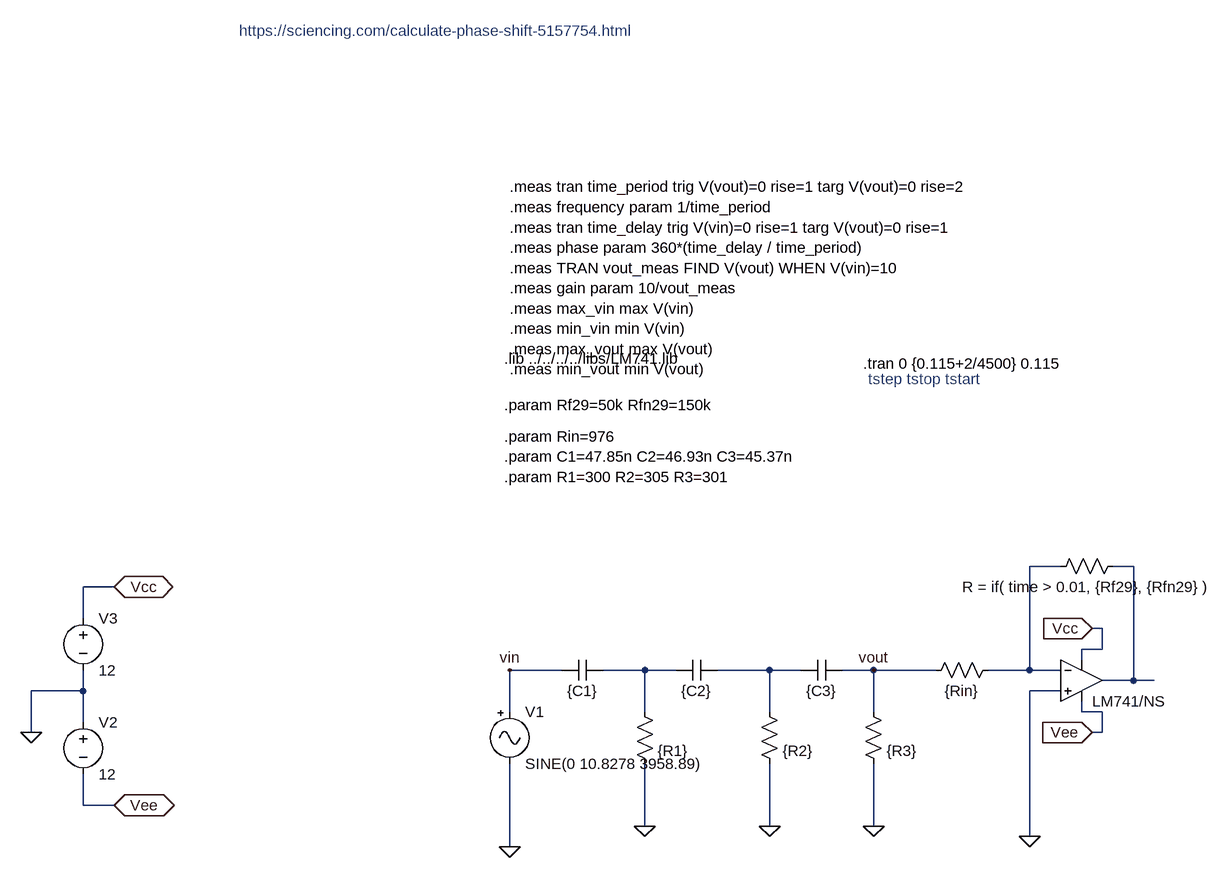
[diagram p0: schematic debugB_practical.asc]
debugB_practical.asc, the LTspice schematic file:
Version 4
SHEET 1 1348 1128
WIRE 752 -112 704 -112
WIRE 864 -112 832 -112
WIRE -704 -80 -752 -80
WIRE -752 -32 -752 -80
WIRE 816 -16 800 -16
WIRE 816 16 816 -16
WIRE 816 16 784 16
WIRE 784 32 784 16
WIRE -16 48 -96 48
WIRE 112 48 48 48
WIRE 160 48 112 48
WIRE 304 48 224 48
WIRE 352 48 304 48
WIRE 464 48 416 48
WIRE 560 48 464 48
WIRE 704 48 704 -112
WIRE 704 48 640 48
WIRE 752 48 704 48
WIRE 864 64 864 -112
WIRE 864 64 816 64
WIRE 896 64 864 64
WIRE -752 80 -752 48
WIRE -752 80 -832 80
WIRE 752 80 704 80
WIRE -96 112 -96 48
WIRE 112 112 112 48
WIRE 304 112 304 48
WIRE 464 112 464 48
WIRE 784 112 784 96
WIRE 816 112 784 112
WIRE -752 128 -752 80
WIRE -832 144 -832 80
WIRE 816 144 816 112
WIRE 816 144 800 144
WIRE -752 256 -752 208
WIRE -704 256 -752 256
WIRE 112 288 112 192
WIRE 304 288 304 192
WIRE 464 288 464 192
WIRE 704 304 704 80
WIRE -96 320 -96 192
FLAG 112 288 0
FLAG 304 288 0
FLAG 800 -16 Vcc
IOPIN 800 -16 In
FLAG 800 144 Vee
IOPIN 800 144 In
FLAG 704 304 0
FLAG 464 288 0
FLAG -832 144 0
FLAG -704 -80 Vcc
IOPIN -704 -80 BiDir
FLAG -704 256 Vee
IOPIN -704 256 BiDir
FLAG 464 48 vout
FLAG -96 48 vin
FLAG -96 320 0
SYMBOL opamp2 784 0 R0
WINDOW 0 16 32 Invisible 2
SYMATTR InstName U1
SYMATTR Value LM741/NS
SYMBOL res 848 -128 R90
WINDOW 0 0 56 Invisible 2
WINDOW 3 32 56 VTop 2
SYMATTR InstName R1
SYMATTR Value R = if( time > 0.01, {Rf29}, {Rfn29} )
SYMBOL res 656 32 R90
WINDOW 0 0 56 Invisible 2
WINDOW 3 32 56 VTop 2
SYMATTR InstName R2
SYMATTR Value {Rin}
SYMBOL cap 48 32 R90
WINDOW 0 0 32 Invisible 2
WINDOW 3 32 32 VTop 2
SYMATTR InstName C1
SYMATTR Value {C1}
SYMBOL cap 224 32 R90
WINDOW 0 0 32 Invisible 2
WINDOW 3 32 32 VTop 2
SYMATTR InstName C2
SYMATTR Value {C2}
SYMBOL cap 416 32 R90
WINDOW 0 0 32 Invisible 2
WINDOW 3 32 32 VTop 2
SYMATTR InstName C3
SYMATTR Value {C3}
SYMBOL res 96 96 R0
WINDOW 0 36 40 Invisible 2
SYMATTR InstName R3
SYMATTR Value {R1}
SYMBOL res 288 96 R0
WINDOW 0 36 40 Invisible 2
SYMATTR InstName R4
SYMATTR Value {R2}
SYMBOL res 448 96 R0
WINDOW 0 36 40 Invisible 2
SYMATTR InstName R5
SYMATTR Value {R3}
SYMBOL voltage -752 112 R0
SYMATTR InstName V2
SYMATTR Value 12
SYMBOL voltage -752 -48 R0
SYMATTR InstName V3
SYMATTR Value 12
SYMBOL Misc/signal -96 96 R0
SYMATTR InstName V1
SYMATTR Value SINE(0 10.8278 3958.89)
TEXT -104 -432 Left 2 !.lib ../../../../libs/LM741.lib
TEXT -104 -312 Left 2 !.param Rin=976\n.param C1=47.85n C2=46.93n C3=45.37n\n.param R1=300 R2=305 R3=301
TEXT 448 -424 Left 2 !.tran 0 {0.115+2/4500} 0.115
TEXT 456 -400 Left 2 ;tstep tstop tstart
TEXT -104 -360 Left 2 !.param Rf29=50k Rfn29=150k
TEXT -96 -696 Left 2 !.meas tran time_period trig V(vout)=0 rise=1 targ V(vout)=0 rise=2\n.meas frequency param 1/time_period\n.meas tran time_delay trig V(vin)=0 rise=1 targ V(vout)=0 rise=1\n.meas phase param 360*(time_delay / time_period)\n.meas TRAN vout_meas FIND V(vout) WHEN V(vin)=10\n.meas gain param 10/vout_meas\n.meas max_vin max V(vin)\n.meas min_vin min V(vin)\n.meas max_vout max V(vout)\n.meas min_vout min V(vout)
TEXT -512 -936 Left 2 ;https://sciencing.com/calculate-phase-shift-5157754.html

The netlist it stands for:
* debugB_practical.asc
XU1 0 N001 Vcc Vee N002 LM741/NS  ; pins In+ In- V+ V- OUT
R1 N002 N001 R = if( time > 0.01, {Rf29}, {Rfn29} )
R2 N001 vout {Rin}
C1 N003 vin {C1}
C2 N004 N003 {C2}
C3 vout N004 {C3}
R3 N003 0 {R1}
R4 N004 0 {R2}
R5 vout 0 {R3}
V2 0 Vee 12
V3 Vcc 0 12
V1 vin 0 SINE(0 10.8278 3958.89)
.lib ../../../../libs/LM741.lib
.param Rin=976
.param C1=47.85n C2=46.93n C3=45.37n
.param R1=300 R2=305 R3=301
.tran 0 {0.115+2/4500} 0.115
* tstep tstop tstart
.param Rf29=50k Rfn29=150k
.meas tran time_period trig V(vout)=0 rise=1 targ V(vout)=0 rise=2
.meas frequency param 1/time_period
.meas tran time_delay trig V(vin)=0 rise=1 targ V(vout)=0 rise=1
.meas phase param 360*(time_delay / time_period)
.meas TRAN vout_meas FIND V(vout) WHEN V(vin)=10
.meas gain param 10/vout_meas
.meas max_vin max V(vin)
.meas min_vin min V(vin)
.meas max_vout max V(vout)
.meas min_vout min V(vout)
* https://sciencing.com/calculate-phase-shift-5157754.html
.backanno
.end